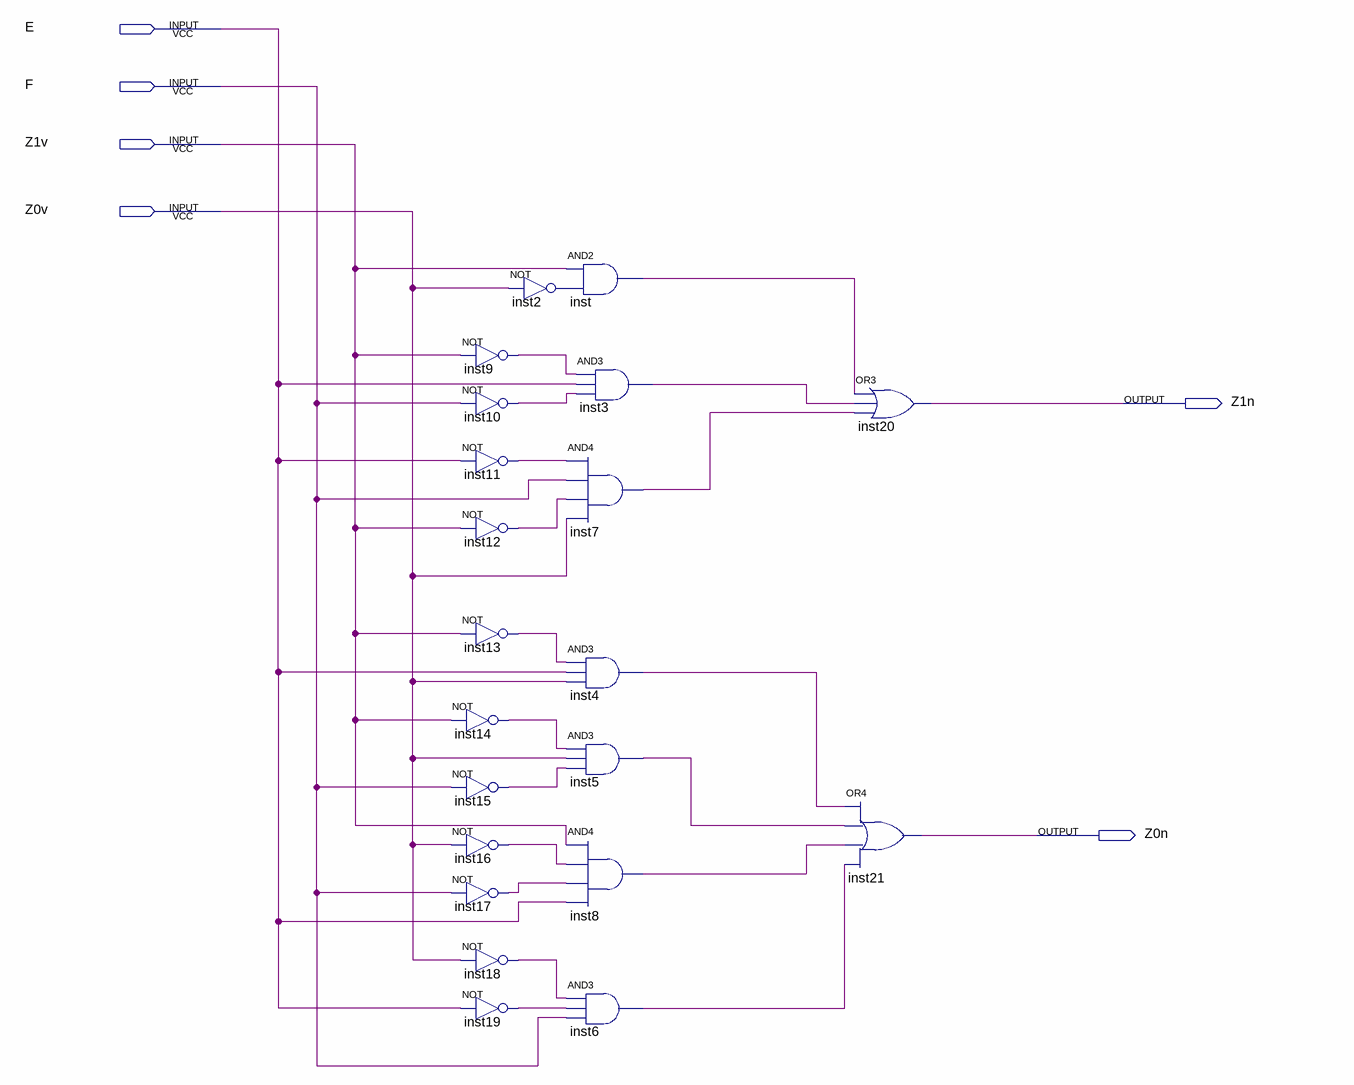
[diagram p0: schematic sheet]
// Quartus schematic NSL.bdf as structural Verilog: 21 symbols, 6 pins
module NSL (
  input  E,
  input  F,
  input  Z1v,
  input  Z0v,
  output Z1n,
  output Z0n
);

  wire inst2_out, inst3_out, inst4_out, inst5_out, inst6_out, inst7_out, inst8_out, inst9_out, inst10_out,
       inst11_out, inst12_out, inst13_out, inst14_out, inst15_out, inst16_out, inst17_out, inst18_out,
       inst19_out, inst_out;

  not inst14 (inst14_out, Z1v);
  not inst15 (inst15_out, F);
  not inst16 (inst16_out, Z0v);
  not inst17 (inst17_out, F);
  not inst2 (inst2_out, Z0v);
  not inst9 (inst9_out, Z1v);
  not inst10 (inst10_out, F);
  not inst11 (inst11_out, E);
  not inst12 (inst12_out, Z1v);
  not inst13 (inst13_out, Z1v);
  not inst18 (inst18_out, Z0v);
  not inst19 (inst19_out, E);
  and inst (inst_out, Z1v, inst2_out);
  and inst3 (inst3_out, inst9_out, E, inst10_out);
  and inst7 (inst7_out, inst11_out, F, inst12_out, Z0v);
  and inst4 (inst4_out, inst13_out, E, Z0v);
  and inst5 (inst5_out, inst14_out, Z0v, inst15_out);
  and inst8 (inst8_out, Z1v, inst16_out, inst17_out, E);
  and inst6 (inst6_out, inst18_out, inst19_out, F);
  or inst20 (Z1n, inst_out, inst3_out, inst7_out);
  or inst21 (Z0n, inst4_out, inst5_out, inst8_out, inst6_out);
endmodule
